# Altium schematic sheet LED_DriverR3.SchDoc: LED Driver
size A; Revision: 3; SheetNumber: 5; SheetTotal: 5; RevisionHistory: Updated from v3.2 Miniscope.org
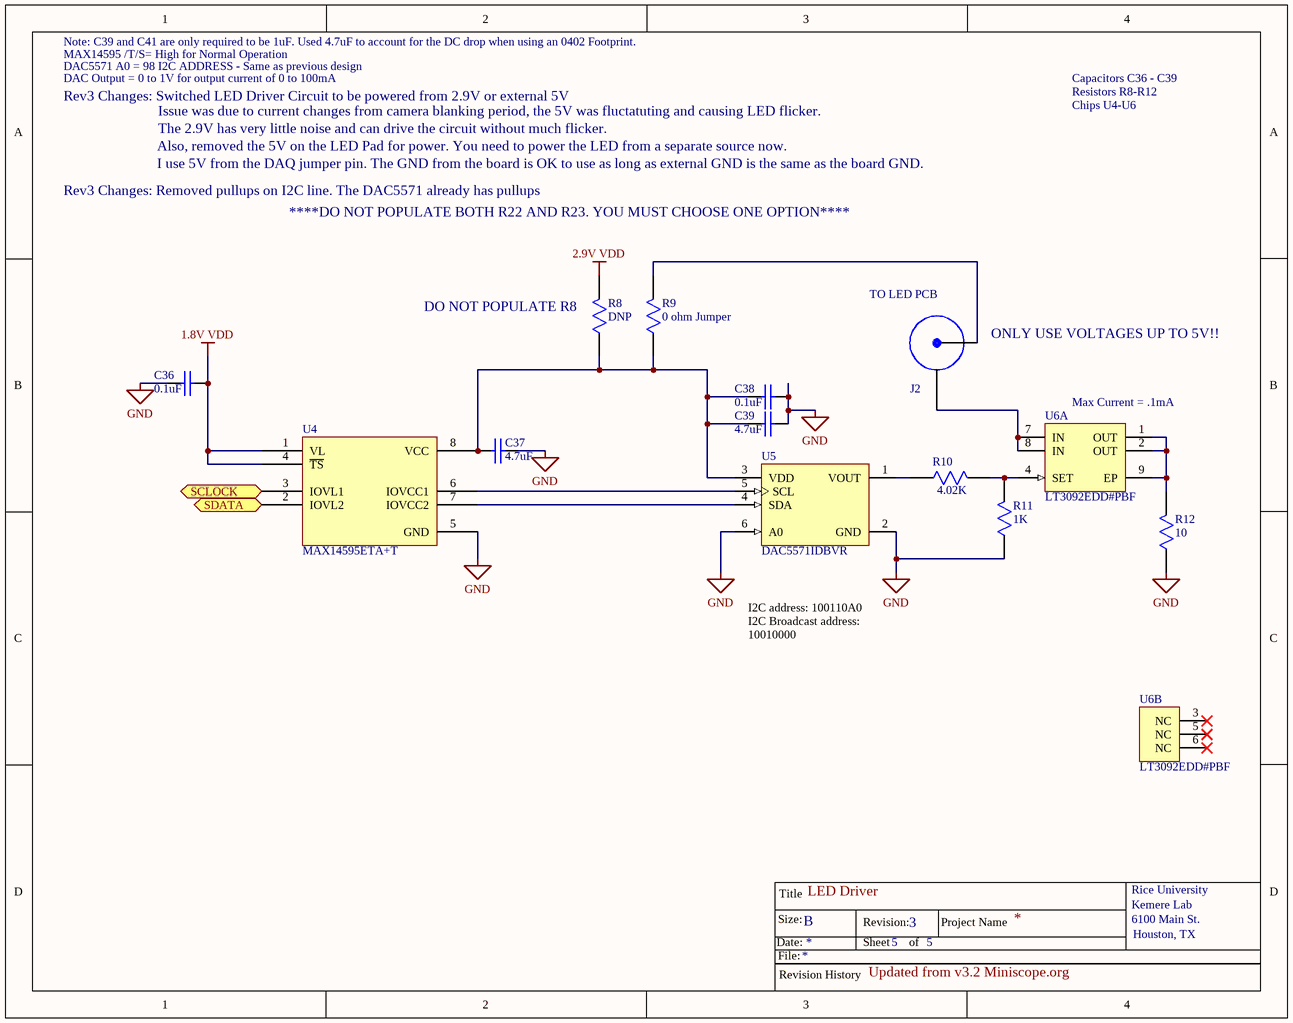
[diagram p0: LED_DriverR3.SchDoc]

## Parts
C36  0.1uF  [SMD CAP 0402]
C37  4.7uF  [SMD CAP 0402]
C38  0.1uF  [SMD CAP 0402]
C39  4.7uF  [SMD CAP 0402]
J2  Coax Connector  [Coax Direct Solder ThroughHoles]  (value not drawn)
R8  DNP  [SMD RES 0402]
R9  0 ohm Jumper  [SMD RES 0402]
R10  4.02K  [SMD RES 0402]
R11  1K  [SMD RES 0402]
R12  10  [SMD RES 0402]
U4  MAX14595ETA+T  [8 TDFN]
U5  DAC5571IDBVR  [DBV]
U6  LT3092EDD#PBF  [LT-DD-8_V]  (parts A,B of 2)

## Ports
SCLOCK (in), SDATA (bidir)

## Nets
1.8V VDD: C36.1 U4.1(VL) U4.4(~{TS})
2.9V VDD: R8.1
GND: C36.0 C37.1 C38.1 C39.1 R11.0 R12.0 U4.5(GND) U5.2(GND) U5.6(A0)
SCLOCK: U4.3(IOVL1) ; port SCLOCK
SDATA: U4.2(IOVL2) ; port SDATA
NetC37_0: C37.0 C38.0 C39.0 R8.0 R9.0 U4.8(VCC) U5.3(VDD)
NetJ2_0: J2.0 R9.1
NetJ2_1: J2.1 U6.7(IN) U6.8(IN)
NetR10_0: R10.0 U5.1(VOUT)
NetR10_1: R10.1 R11.1 U6.4(SET)
NetR12_1: R12.1 U6.1(OUT) U6.2(OUT) U6.9(EP)
NetU4_6: U4.6(IOVCC1) U5.5(SCL)
NetU4_7: U4.7(IOVCC2) U5.4(SDA)

Not connected (* = marked no-connect by the designer): U6 3(NC)* 5(NC)* 6(NC)*

## Notes on the sheet
- DAC Output = 0 to 1V for output current of 0 to 100mA
- Note: C39 and C41 are only required to be 1uF. Used 4.7uF to account for the DC drop when using an 0402 Footprint.
- MAX14595 /T/S= High for Normal Operation
- DAC5571 A0 = 98 I2C ADDRESS - Same as previous design
- Rev3 Changes: Switched LED Driver Circuit to be powered from 2.9V or external 5V
- Capacitors C36 - C39
- Resistors R8-R12
- Also, removed the 5V on the LED Pad for power. You need to power the LED from a separate source now.
- I use 5V from the DAQ jumper pin. The GND from the board is OK to use as long as external GND is the same as the board GND.
- Issue was due to current changes from camera blanking period, the 5V was fluctatuting and causing LED flicker.
- The 2.9V has very little noise and can drive the circuit without much flicker.
- Chips U4-U6
- Rev3 Changes: Removed pullups on I2C line. The DAC5571 already has pullups
- ****DO NOT POPULATE BOTH R22 AND R23. YOU MUST CHOOSE ONE OPTION****
- (near J2) TO LED PCB
- (near R8) DO NOT POPULATE R8
- ONLY USE VOLTAGES UP TO 5V!!
- (near U6) Max Current = .1mA
- I2C address: 100110A0
  I2C Broadcast address: 10010000
- Title
- Rice University
- Kemere Lab
- Date:
- Size:
- File:
- Revision History
- B
- Revision:
- Sheet
- of
- Project Name
- 6100 Main St.
- Houston, TX

## Library data of the parts
C36-C39 = Capacitor: Value: C?
R8-R12 = Resistor: Value: ?
U4 = MAX14595ETA+T: Level Translator
U5 = DAC5571
U6 = LT3092EDD#PBF: 200 mA Two-Terminal Programmable Current Source, 0.3 mA Isupply, 8-pin SON (DD-8), -40 to 125 degC, Pb-Free; Manufacturer: Linear Technology; Extended Temp: E, I, MP; Initial Accuracy(%): 1; Isupply(mA): 0.3; Output Current Range: 0.5 mA to 200 mA; Vin Max(V): 40; Vin Min(V): 1.2; DatasheetVersion: Rev. B; PackageVersion: Jun-10; PackageReference: DD-8; PackageDescription: 8-Pin Plastic DFN, Body 3 x 3 mm, Pitch 0.5 mm; Supplier 1: Digi-Key; Supplier Part Number 1: LT3092EDD#PBF-ND; Supplier 2: Farnell; Supplier Part Number 2: 2295468; Supplier 3: Newark; Supplier Part Number 3: 72R5810; RoHS: TRUE; Mounting Technology: Surface Mount; Code_JEDEC: MO-229; PartNumber: LT3092EDD#PBF; ComponentLink1Description: Manufacturer URL; ComponentLink1URL: http://www.linear.com/; ComponentLink2Description: Datasheet; ComponentLink2URL: http://cds.linear.com/docs/en/datasheet/3092fb.pdf; ComponentLink3Description: Package Specification; ComponentLink3URL: http://cds.linear.com/docs/en/packaging/DFN_8_05-08-1698.pdf